# Altium schematic sheet Sheet1.SchDoc
size A4
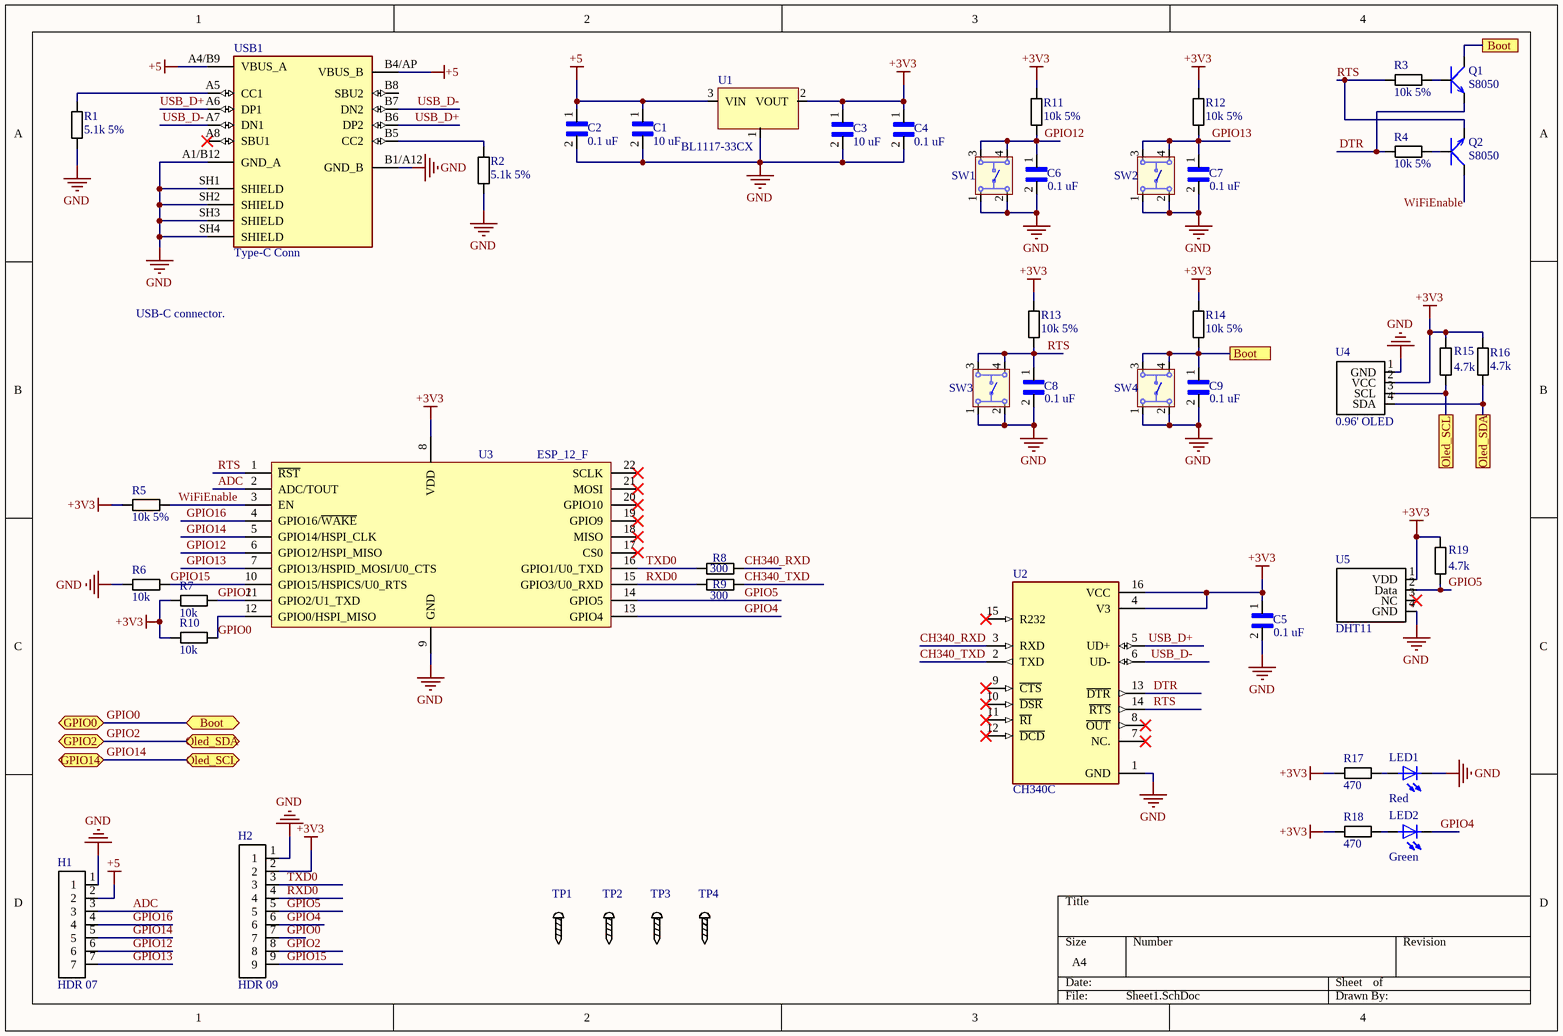
[diagram p0: Sheet1.SchDoc]

## Parts
C1  10 uF  [CAPC2012X135N]
C2  0.1 uF  [CAPC2012X135N - duplicate]
C3  10 uF  [CAPC2012X135N]
C4  0.1 uF  [CAPC2012X135N - duplicate]
C5  0.1 uF  [CAPC2012X135N - duplicate]
C6  0.1 uF  [CAPC2012X135N - duplicate]
C7  0.1 uF  [CAPC2012X135N - duplicate]
C8  0.1 uF  [CAPC2012X135N - duplicate]
C9  0.1 uF  [CAPC2012X135N - duplicate]
H1  HDR 07  [HDR 07]
H2  HDR 09  [HDR 09]
LED1  Red  [LEDC2012X70N]
LED2  Green  [LEDC2012X70N]
Q1  S8050  [SOT-23]
Q2  S8050  [SOT-23]
R1  5.1k 5%  [R0805]
R2  5.1k 5%  [R0805]
R3  10k 5%  [R0805]
R4  10k 5%  [R0805]
R5  10k 5%  [R0805]
R6  10k  [R0805]
R7  10k  [R0805]
R8  300  [R0805]
R9  300  [R0805]
R10  10k  [R0805]
R11  10k 5%  [R0805]
R12  10k 5%  [R0805]
R13  10k 5%  [R0805]
R14  10k 5%  [R0805]
R15  4.7k  [R0805]
R16  4.7k  [R0805]
R17  470  [R0805]
R18  470  [R0805]
R19  4.7k  [R0805]
SW1  Tack switch  [430453025836]  (value not drawn)
SW2  Tack switch  [430453025836]  (value not drawn)
SW3  Tack switch  [430453025836]  (value not drawn)
SW4  Tack switch  [430453025836]  (value not drawn)
TP1  MH M3  [MH_M3]  (value not drawn)
TP2  MH M3  [MH_M3]  (value not drawn)
TP3  MH M3  [MH_M3]  (value not drawn)
TP4  MH M3  [MH_M3]  (value not drawn)
U1  BL1117-33CX  [SOT-223-2]
U2  CH340C  [SOIC127P600X180-16N]
U3  ESP_12_F  [ESP_12_F]
U4  0.96' OLED  [0.96 OLED_temp]
U5  DHT11  [DHT11]
USB1  Type-C Conn  [TE_2340901-1]

## Ports
Boot, Boot (bidir), GPIO0 (bidir), GPIO2 (bidir), GPIO14 (bidir), Oled_SCL, Oled_SCL (bidir), Oled_SDA, Oled_SDA (bidir)

## Nets
+3V3: C3.1 C4.1 C5.1 H2.2 R5.2 R7.1 R10.1 R11.2 R12.2 R13.2 R14.2 R15.2 R16.2 R17.1 R18.1 R19.2 U1.2(VOUT) U2.4(V3) U2.16(VCC) U3.8(VDD) U4.2(VCC) U5.1(VDD)
+5: C1.1 C2.1 H1.2 U1.3(VIN) USB1.A4/B9(VBUS_A) USB1.B4/AP(VBUS_B)
GND: C1.2 C2.2 C3.2 C4.2 C5.2 C6.2 C7.2 C8.2 C9.2 H1.1 H2.1 LED1.C R1.1 R2.1 R6.1 SW1.1 SW1.2 SW2.1 SW2.2 SW3.1 SW3.2 SW4.1 SW4.2 U1.1(GND) U2.1(GND) U3.9(GND) U4.1(GND) U5.4(GND) USB1.A1/B12(GND_A) USB1.B1/A12(GND_B) USB1.SH1(SHIELD) USB1.SH2(SHIELD) USB1.SH3(SHIELD) USB1.SH4(SHIELD)
ADC: H1.3 U3.2(ADC/TOUT)
CH340_RXD: R8.2 U2.3(RXD)
CH340_TXD: R9.2 U2.2(TXD)
DTR: Q1.2(E) R4.1 U2.13(~{DTR})
GPIO0: C9.1 H2.7 Q1.3(C) R10.2 R14.1 SW4.3 SW4.4 U3.12(GPIO0/HSPI_MISO) ; port Boot, port GPIO0
GPIO2: H2.8 R7.2 R16.1 U3.11(GPIO2/U1_TXD) U4.4(SDA) ; port Oled_SDA, port GPIO2
GPIO4: H2.6 LED2.C U3.13(GPIO4)
GPIO5: H2.5 R19.1 U3.14(GPIO5) U5.2(Data)
GPIO12: C6.1 H1.6 R11.1 SW1.3 SW1.4 U3.6(GPIO12/HSPI_MISO)
GPIO13: C7.1 H1.7 R12.1 SW2.3 SW2.4 U3.7(GPIO13/HSPID_MOSI/U0_CTS)
GPIO14: H1.5 R15.1 U3.5(GPIO14/HSPI_CLK) U4.3(SCL) ; port Oled_SCL, port GPIO14
GPIO15: H2.9 R6.2 U3.10(GPIO15/HSPICS/U0_RTS)
GPIO16: H1.4 U3.4(GPIO16/~{WAKE})
RTS: C8.1 Q2.2(E) R3.1 R13.1 SW3.3 SW3.4 U2.14(~{RTS}) U3.1(~{RST})
RXD0: H2.4 R9.1 U3.15(GPIO3/U0_RXD)
TXD0: H2.3 R8.1 U3.16(GPIO1/U0_TXD)
USB_D+: U2.5(UD+) USB1.A6(DP1) USB1.B6(DP2)
USB_D-: U2.6(UD-) USB1.A7(DN1) USB1.B7(DN2)
WiFiEnable: Q2.3(C) R5.1 U3.3(EN)
NetLED1_A: LED1.A R17.2
NetLED2_A: LED2.A R18.2
NetQ1_1: Q1.1(B) R3.2
NetQ2_1: Q2.1(B) R4.2
NetR1_2: R1.2 USB1.A5(CC1)
NetR2_2: R2.2 USB1.B5(CC2)

Not connected (* = marked no-connect by the designer): U2 7(NC.)* 8(~{OUT})* 9(~{CTS})* 10(~{DSR})* 11(~{RI})* 12(~{DCD})* 15(R232)*; U3 17(CS0)* 18(MISO)* 19(GPIO9)* 20(GPIO10)* 21(MOSI)* 22(SCLK)*; U5 3(NC)*; USB1 A8(SBU1)* B8(SBU2)

## Notes on the sheet
- USB-C connector.

## Library data of the parts
C1 C3 = GRT21BR61C106KE01L: SMD Capacitor X5R(EIA) with Capacitance: 10uF Tol. 10%. Rated Voltage: 16Vdc; MF: Murata; Price: None; MP: GRT21BR61C106KE01L; Value: *; Availability: Good; Package: 0805 Murata
C2 C4-C9 = GCM21BR71H104KA37K: SMD Capacitor X7R(EIA) with Capacitance: 0.10uF Tol. 10%. Rated Voltage: 50Vdc; MF: Murata; Value: *; MP: GCM21BR71H104KA37K; Package: 0805 Murata
H1 = HDR 07: TE conn, HDR 7 Assy, MOD II, TH 2.54 mm
H2 = HDR 09: TE conn, HDR 9 Assy, MOD II, TH 2.54 mm
LED1 LED2 = 597-5111-402F: SMD LED 0805 R SAMPLE STRIP | Dialight 597-5111-402F
Q1 Q2 = SMD-TRANSISTORS-NPN-25V-500MW(SOT-23): Bipolar (BJT) Transistor NPN 25 V 500 mA 150MHz 300 mW Surface Mount SOT-23; MF: UMW; MP: S8050; Value: *
R1 R2 = R 5.1k 5%: Availability: Unavailable; Price: None; Package: 0805; Value: 5.1K
R3-R7 R10-R14 = 10k 5%: Value: 5.1K; Availability: Unavailable; Price: None; Package: 0805
R8 R9 = 300: 5%; Availability: Unavailable; Price: None; Package: 0805; Value: 300
R15 R16 R19 = 4.7k 5%: Availability: Unavailable; Price: None; Package: 0805; Value: 4.7K
R17 R18 = 470: 5%; Availability: Unavailable; Price: None; Package: 0805; Value: 470
SW1-SW4 = Tack switch: WS-TASV J-Bend SMD Tact Switch 6X6 mm; NoPins: 04
TP1-TP4 = MH M3: Mounting hole
U1 = BL1117-18CX
U2 = CH340C: USB to serial chip CH340
U3 = ESP_12_F: ESP-12F Wi-Fi Module by AI-Thinker
U4 = 0.96 OLED_temp
USB1 = Type-C Conn: USB Type C 2.0 Conn